# Altium schematic sheet HC06_Schem.SchDoc
size A; SheetNumber: 5; SheetTotal: 6
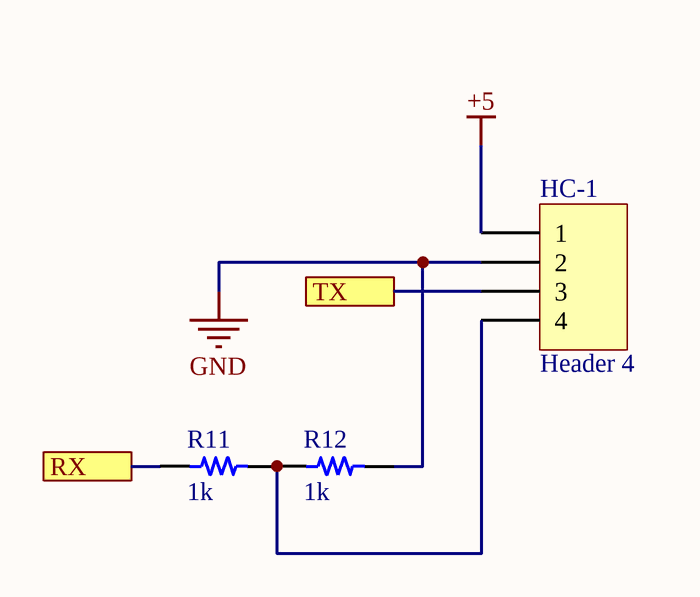
[diagram p0: HC06_Schem.SchDoc]

## Parts
HC-1  Header 4  [HDR1X4]
R11  1k  [RES 1206_3216]
R12  1k  [RES 1206_3216]

## Ports
RX, TX

## Nets
+5: HC-1.1
GND: HC-1.2 R12.1
RX: R11.2 ; port RX
TX: HC-1.3 ; port TX
NetHC-1_4: HC-1.4 R11.1 R12.2

## Library data of the parts
HC-1 = Header 4: Header, 4-Pin; LatestRevisionDate: 17-Jul-2002; LatestRevisionNote: Re-released for DXP Platform.; Publisher: Altium Limited
R11 R12 = ESR18EZPF1002: RES SMD 10K OHM 1% 1/2W 1206; Manufacturer: Rohm Semiconductor; Power (Watts): 0.5W, 1/2W; Resistance: 10 kOhms; Temperature Coefficient: ±100ppm/°C; Value: 10 kOhms; Part Number: ESR18EZPF1002; ComponentLink1Description: Datasheet; ComponentLink1URL: https://www.rohm.com/datasheet/ESR01MZPF/esr-e; ComponentLink2Description: DigiKey Link; ComponentLink2URL: https://www.digikey.com/en/products/detail/rohm-semiconductor/ESR18EZPF1002/1983592; Composition: Thick Film; Device Package: 1206 (3216 Metric); Features: Automotive AEC-Q200, Pulse Withstanding; Height - Seated (Max): 0.026" (0.65mm); LastUpdated: 9/19/2022 1:29:57 PM; Lifecycle Status: Active; Minimum Order: 1; Number of Terminations: 2; Operating Temperature: -55°C ~ 155°C; Package / Case: 1206 (3216 Metric); Packaging: TapeAndReel; PartId: 26965; Part Status: Active; Price: 0.02; Ratings: AEC-Q200; Series: ESR; Size / Dimension: 0.126" L x 0.063" W (3.20mm x 1.60mm); Supplier 1: DigiKey; Supplier Part Number 1: RHM10.0KAFCT-ND; Supplier Device Package: 1206; Tolerance: ±1%